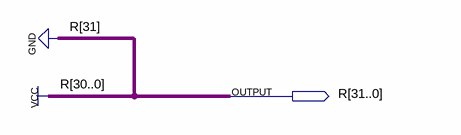
[diagram p0: schematic sheet]
// Quartus schematic Num_Grande.bdf as structural Verilog: 0 symbols, 1 pins
module Num_Grande (
  output [31:0] R
);


  assign R = 32'b01111111111111111111111111111111;
endmodule
